# EAGLE design prod_board (EAGLE 9.0.0)
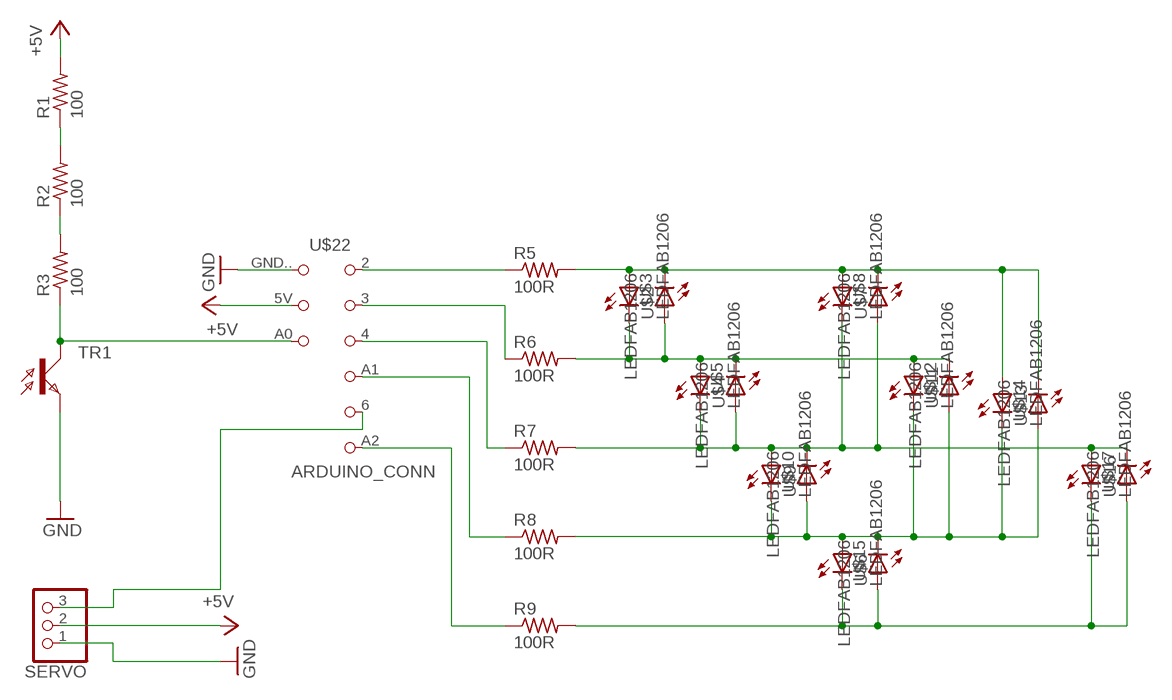
[diagram p0: schematic, sheet 1]

## Parts
R1  100  RES-US1206FAB  [R1206FAB]
R2  100  RES-US1206FAB  [R1206FAB]
R3  100  RES-US1206FAB  [R1206FAB]
R5  100R  RES-US1206FAB  [R1206FAB]
R6  100R  RES-US1206FAB  [R1206FAB]
R7  100R  RES-US1206FAB  [R1206FAB]
R8  100R  RES-US1206FAB  [R1206FAB]
R9  100R  RES-US1206FAB  [R1206FAB]
SERVO  PINHD-1X3  [1X03]
TR1  PHOTOTRANSISTOR-NPN1206  [OP1206]
U$2  LEDFAB1206  [LED1206FAB]
U$3  LEDFAB1206  [LED1206FAB]
U$4  LEDFAB1206  [LED1206FAB]
U$5  LEDFAB1206  [LED1206FAB]
U$6  LEDFAB1206  [LED1206FAB]
U$7  LEDFAB1206  [LED1206FAB]
U$8  LEDFAB1206  [LED1206FAB]
U$9  LEDFAB1206  [LED1206FAB]
U$10  LEDFAB1206  [LED1206FAB]
U$11  LEDFAB1206  [LED1206FAB]
U$12  LEDFAB1206  [LED1206FAB]
U$13  LEDFAB1206  [LED1206FAB]
U$14  LEDFAB1206  [LED1206FAB]
U$15  LEDFAB1206  [LED1206FAB]
U$16  LEDFAB1206  [LED1206FAB]
U$17  LEDFAB1206  [LED1206FAB]
U$22  ARDUINO_CONN  [ARDUINO_UNO]

## Nets
+5V: R1.2 SERVO.2 U$22.5V
GND: SERVO.1 TR1.E U$22.GND..(GND)
N$1: R2.1 R3.2
N$2: R1.1 R2.2
N$3: R5.1 U$22.2(D2)
N$4: R3.1 TR1.C U$22.A0
N$5: R5.2 U$2.1(A) U$3.2(C) U$7.1(A) U$8.2(C) U$13.1(A) U$14.2(C)
N$6: R6.2 U$2.2(C) U$3.1(A) U$4.1(A) U$5.2(C) U$11.1(A) U$12.2(C)
N$7: R7.2 U$4.2(C) U$5.1(A) U$7.2(C) U$8.1(A) U$9.1(A) U$10.2(C) U$16.1(A) U$17.2(C)
N$8: R8.2 U$6.1(A) U$9.2(C) U$10.1(A) U$11.2(C) U$12.1(A) U$13.2(C) U$14.1(A) U$15.2(C)
N$10: R6.1 U$22.3(D3)
N$11: R7.1 U$22.4(D4)
N$12: R8.1 U$22.A1(D5)
N$13: R9.1 U$22.A2(D7)
N$14: SERVO.3 U$22.6(D6)
N$15: R9.2 U$6.2(C) U$15.1(A) U$16.2(C) U$17.1(A)

## Library data of the parts
R1-R3 R5-R9 = fab:RES-US: Resistor (US Symbol) Variants with postfix FAB are widened to allow the routing of internal traces
SERVO = pinhead:PINHD-1X3: PIN HEADER
TR1 = fab:PHOTOTRANSISTOR-NPN
U$2-U$17 = fab:LED: LED
U$22 = solidlib:ARDUINO_CONN

## Board
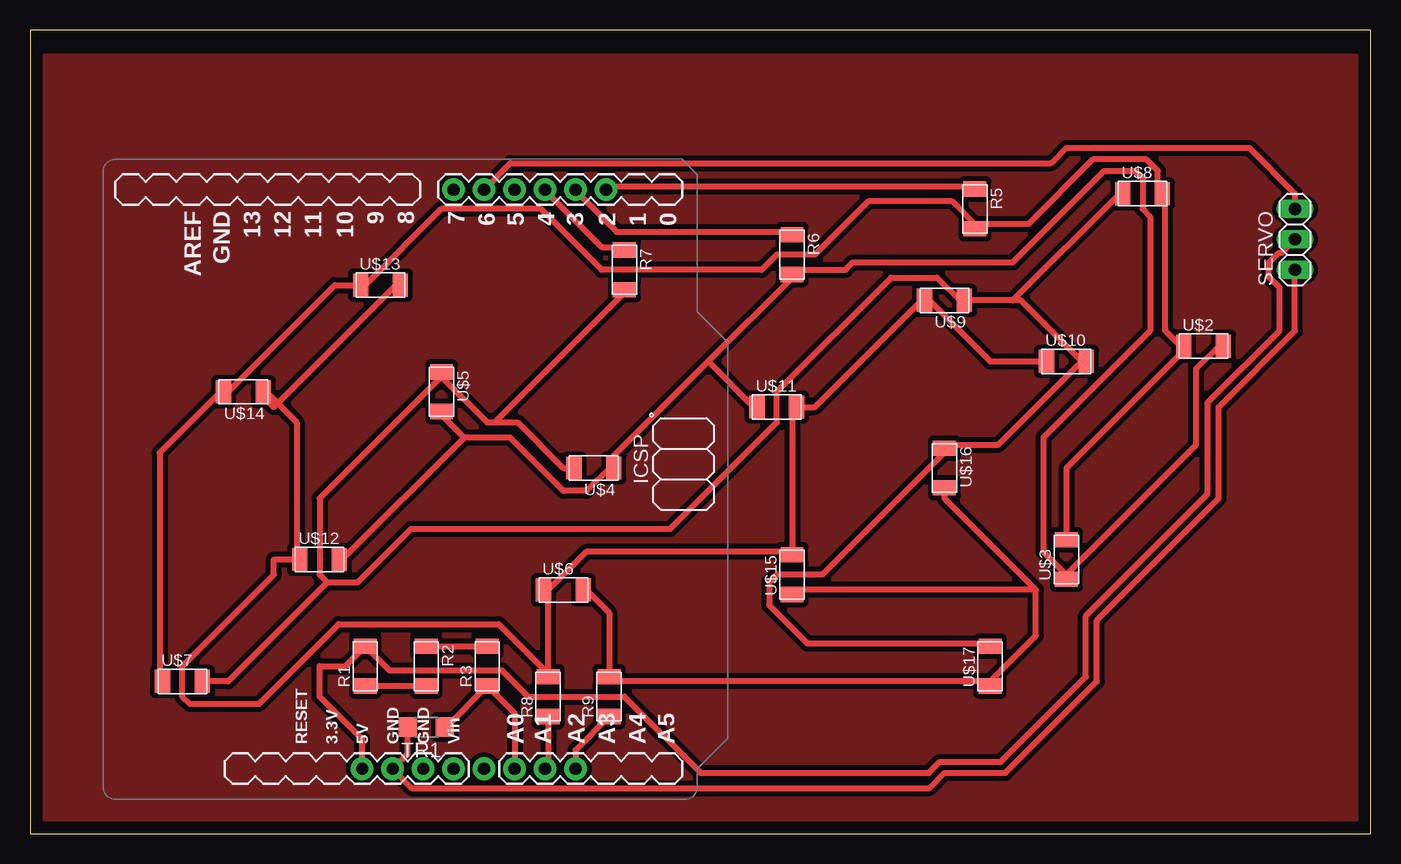
[diagram p1: board, top side]

Size 111.74 x 66.98 mm. Coordinates in mm from the lower left corner, seen from the top.
Outline: 0,0 111.74,0 111.74,66.98 0,66.98 0,0
Copper layers (1*16): Top 0.035mm / dielectric 1.5mm / Bottom 0.035mm
Design rules "default *": minimum track width 20mil, minimum drill 0.35mm, track to track 16mil, track to pad 16mil, pad to pad 16mil, via to via 16mil, smd to smd 16mil, copper to edge 40mil, drill to drill 6mil, minimum pad ring 10mil, minimum via ring 8mil, stop-mask expansion 4mil, vias tented up to drill 0mil, thermal gap 10mil

### Footprints (pad centres in the part's own frame; a part is rotated, then mirrored left to right if it is on the bottom)
R1206FAB = smd 1.27 x 1.905: 1 -1.651,0; 2 1.651,0
1X03 = drill 1.016 long: 1 -2.54,0; 2 0,0; 3 2.54,0
OP1206 = smd 1.5 x 1.6: C -1.55,0; E 1.55,0
LED1206FAB = smd 1.27 x 1.905: 1 -1.651,0; 2 1.651,0
ARDUINO_UNO = drill 1.016 pad 1.88: 2 58.42,50.8; 3 55.88,50.8; 4 53.34,50.8; 5 50.8,50.8; 5V 38.1,2.54; 6 48.26,50.8; 7 45.72,50.8; . 48.26,2.54; A0 50.8,2.54; A1 53.34,2.54; A2 55.88,2.54; GND.1 43.18,2.54; GND.. 40.64,2.54; GND..2 45.72,2.54

### Placement (x,y rotation side)
R1  27.94,13.97 90 top
R2  33.02,13.97 270 top
R3  38.1,13.97 90 top
R5  78.74,52.07 270 top
R6  63.5,48.26 270 top
R7  49.53,46.99 270 top
R8  43.18,11.43 90 top
R9  48.26,11.43 90 top
SERVO  105.41,49.53 90 top
TR1  33.02,8.89 180 top
U$2  97.79,40.64 0 top
U$3  86.36,22.86 90 top
U$4  46.99,30.48 180 top
U$5  34.29,36.83 270 top
U$6  44.45,20.32 0 top
U$7  12.7,12.7 0 top
U$8  92.71,53.34 0 top
U$9  76.2,44.45 180 top
U$10  86.36,39.37 0 top
U$11  62.23,35.56 0 top
U$12  24.13,22.86 0 top
U$13  29.21,45.72 0 top
U$14  17.78,36.83 180 top
U$15  63.5,21.59 90 top
U$16  76.2,30.48 270 top
U$17  80.01,13.97 90 top
U$22  -10.42,2.88 0 top

### Tracks (layer width: path | path; a pad name or v marks a point on that pad's centre or on a via)
+5V
  Top 0.508: U$22.5V 27.68,7.88 24.13,11.43 24.13,13.97 26.29,13.97 R1.2 29.95,13.61 39.33,13.61 41.51,11.43 49.53,11.43 55.88,5.08 74.91,5.08 75.82,5.99 80.9,5.99 87.99,13.08 87.99,18.16 98.15,28.32 98.15,35.94 104.14,41.93 104.14,45.49 103.23,46.4 103.23,47.58 104.06,48.41 104.29,48.41 SERVO.2
GND
  Top 0.508: TR1.E 31.47,6.67 U$22.GND.. 31.83,3.81 74.93,3.81 76.2,5.08 81.28,5.08 88.9,12.7 88.9,17.78 99.06,27.94 99.06,35.56 105.41,41.91 SERVO.1
N$1
  Top 0.508: R2.1 R3.2
N$2
  Top 0.508: R1.1 R2.2
N$3
  Top 0.508: R5.1 78.74,53.98 48.26,53.98 U$22.2
N$4
  Top 0.508: U$22.A0 40.38,10.04 R3.1 34.67,8.89 TR1.C
N$5
  Top 0.508: U$7.1 10.79,12.7 10.79,31.75 15.88,36.83 U$14.2 16.51,36.83 25.4,45.72 U$13.1 27.94,45.72 34.29,52.07 42.55,52.07 47.62,46.99 60.96,46.99 62.23,48.26 65.41,48.26 69.85,52.7 76.83,52.7 78.74,50.8 | 78.74,50.8 83.19,50.8 88.58,56.2 93.03,56.2 93.98,55.24 93.98,53.34 U$8.2 94.61,53.34 94.61,41.91 95.89,40.64 U$2.1 96.52,40.64 86.36,30.48 U$3.2 | 78.74,50.8 R5.2
N$6
  Top 0.508: 86.36,21.59 97.16,32.38 97.16,38.73 99.06,40.64 U$2.2 | 36.2,33.02 26.04,22.86 U$12.2 | 36.2,33.02 34.29,34.92 U$5.2 | 56.52,39.37 60.33,35.56 U$11.1 | 48.9,30.48 U$4.1 | 56.52,39.37 63.5,46.35 R6.2 63.88,46.99 67.94,46.99 68.58,47.62 81.92,47.62 89.53,55.24 92.08,55.24 92.71,54.61 92.71,52.07 93.34,51.44 93.34,41.91 84.45,33.02 84.45,23.5 86.36,21.59 | 36.2,33.02 40.01,33.02 44.45,28.57 46.35,28.57 48.26,30.48 U$4.1 | 86.36,21.59 U$3.1 | 56.52,39.37 48.64,31.5 U$4.1
N$7
  Top 0.508: 87.63,39.37 80.64,32.38 76.2,32.38 U$16.1 76.2,31.75 66.04,21.59 62.23,21.59 61.59,20.95 61.59,19.05 64.77,15.88 80.01,15.88 U$17.2 | 81.92,44.45 82.55,44.45 87.63,39.37 | 81.92,44.45 U$9.1 77.47,44.45 75.56,46.35 71.75,46.35 62.23,36.83 62.23,34.29 53.34,25.4 31.75,25.4 27.3,20.95 24.77,20.95 | 87.63,39.37 U$10.2 | 81.92,44.45 90.81,53.34 U$8.1 | U$7.2 16.51,12.7 24.77,20.95 | 24.77,20.95 24.13,21.59 24.13,27.94 34.29,38.1 | U$4.2 44.45,30.48 40.64,34.29 38.73,34.29 | 38.73,34.29 38.1,34.29 34.29,38.1 | 34.29,38.1 U$5.1 | 38.73,34.29 49.53,45.09 R7.2
N$8
  Top 0.508: 22.23,22.86 22.23,34.29 19.68,36.83 U$14.1 19.05,36.83 20.32,35.56 30.48,45.72 U$13.2 | U$10.1 80.01,39.37 74.93,44.45 U$9.2 74.3,44.45 65.41,35.56 U$11.2 63.5,35.56 63.5,23.5 | 43.18,13.34 43.18,20.32 | 43.18,20.32 46.35,23.5 63.5,23.5 | 43.18,20.32 U$6.1 | 63.5,23.5 U$15.2 | 22.23,22.86 20.32,22.86 20.32,21.59 12.7,13.97 12.7,11.43 13.34,10.79 19.05,10.79 25.72,17.46 39.05,17.46 43.18,13.34 | 22.23,22.86 U$12.1 | 43.18,13.34 R8.2
N$9
  pour Top: 1.27,1.27 110.49,1.27 110.49,64.77 1.27,64.77
N$10
  Top 0.508: R6.1 63.5,50.16 48.9,50.16 45.72,53.34 U$22.3
N$11
  Top 0.508: R7.1 49.53,48.9 47.62,48.9 43.18,53.34 U$22.4
N$12
  Top 0.508: R8.1 43.18,5.68 U$22.A1
N$13
  Top 0.508: R9.1 45.46,6.98 U$22.A2
N$14
  Top 0.508: SERVO.3 105.41,53.34 101.6,57.15 86.36,57.15 85.09,55.88 40.04,55.88 U$22.6
N$15
  Top 0.508: U$6.2 46.35,20.32 48.26,18.41 R9.2 48.26,12.7 80.01,12.7 | 80.01,12.7 83.82,16.51 83.82,20.32 | 83.82,20.32 76.2,27.94 U$16.2 | 83.82,20.32 63.5,20.32 U$15.1 | 80.01,12.7 U$17.1